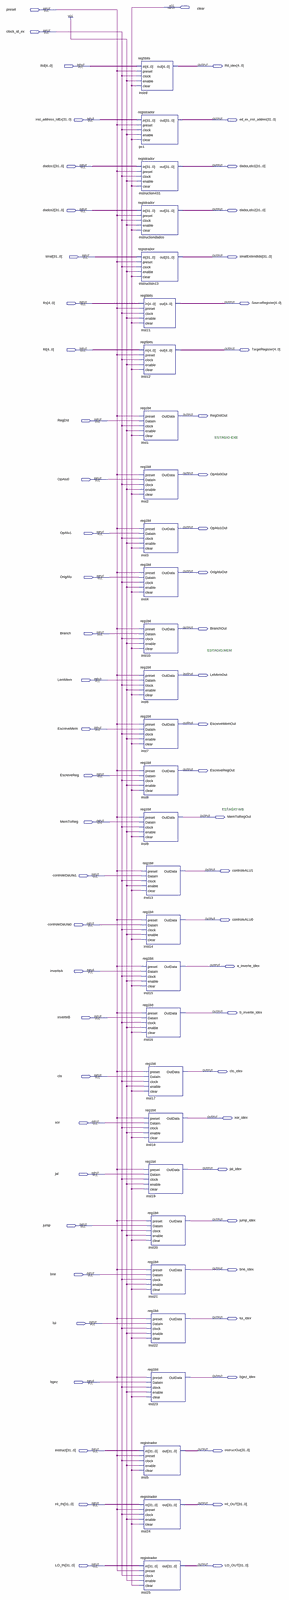
[diagram p0: schematic sheet, whole]
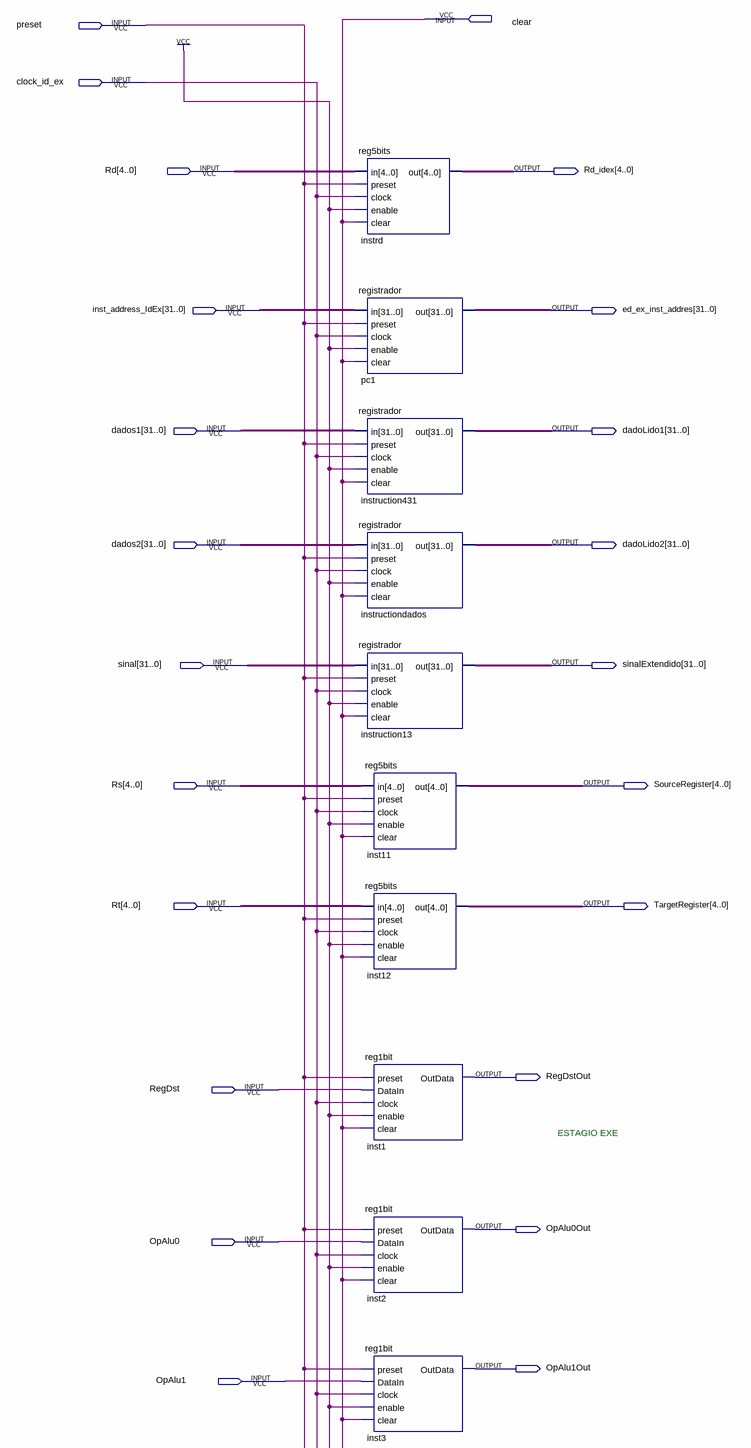
[diagram p1: schematic sheet, upper part]
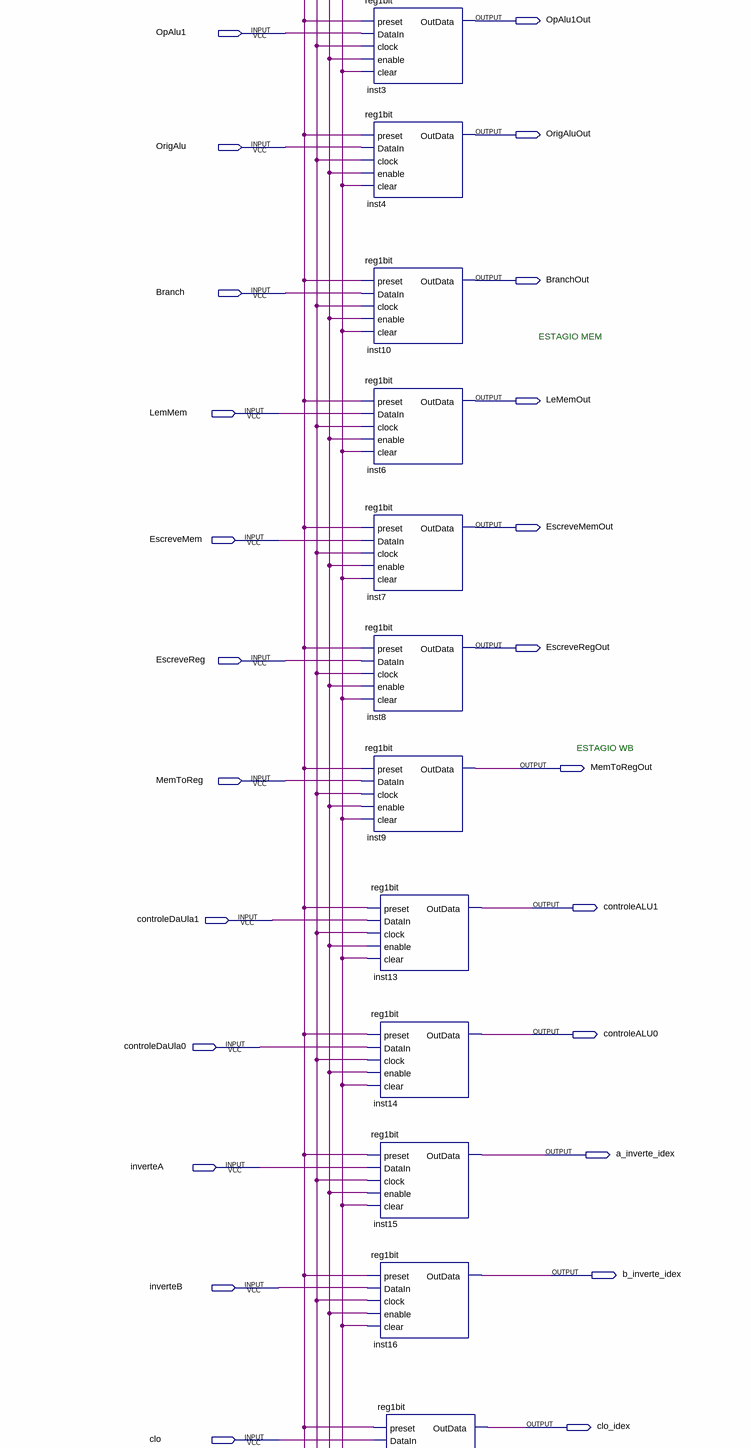
[diagram p2: schematic sheet, middle part]
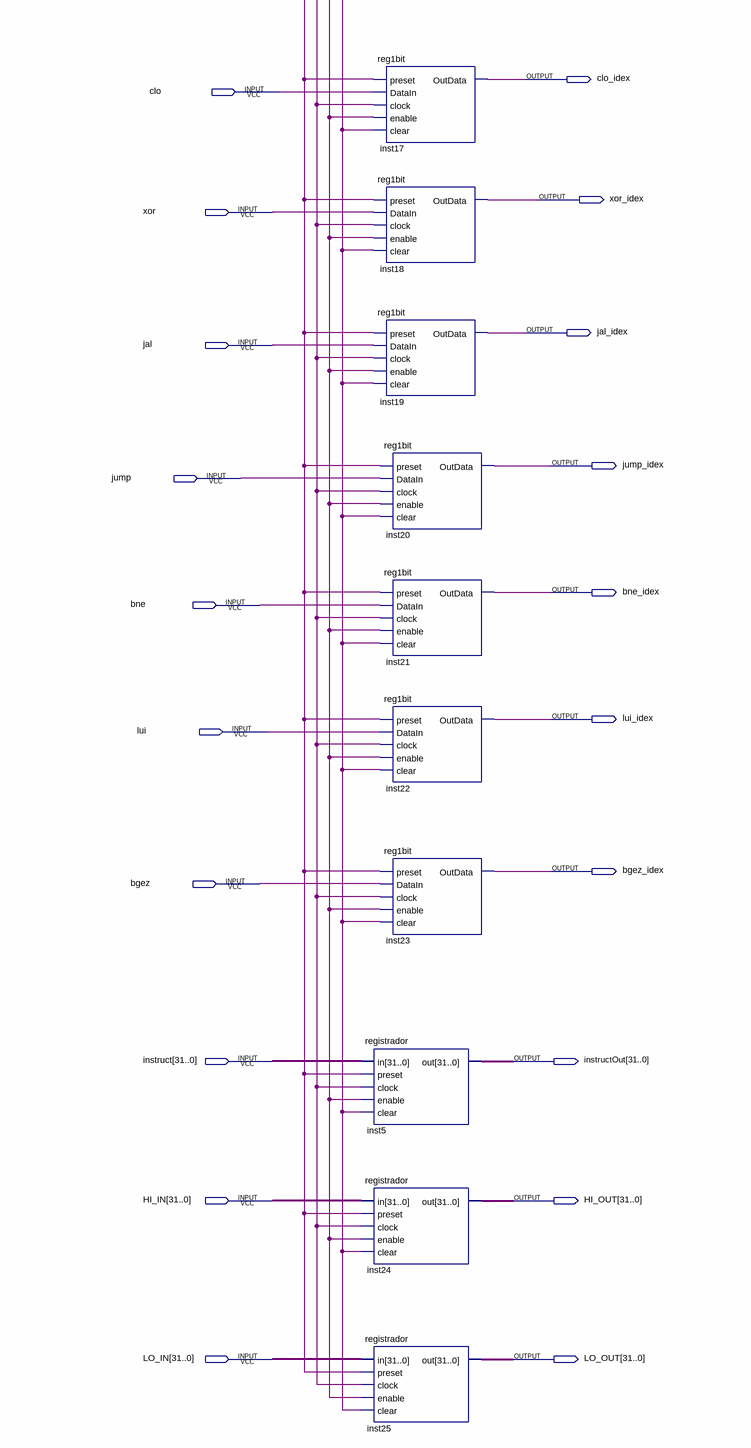
[diagram p3: schematic sheet, lower part]
// Quartus schematic IDEX.bdf as structural Verilog: 30 symbols, 63 pins
module IDEX (
  input  clear,
  input  preset,
  input  clock_id_ex,
  input  [4:0] Rd,
  input  [31:0] inst_address_IdEx,
  input  [31:0] dados1,
  input  [31:0] dados2,
  input  [31:0] sinal,
  input  [4:0] Rs,
  input  [4:0] Rt,
  input  RegDst,
  input  OpAlu0,
  input  OpAlu1,
  input  OrigAlu,
  input  Branch,
  input  LemMem,
  input  EscreveMem,
  input  EscreveReg,
  input  MemToReg,
  input  controleDaUla1,
  input  controleDaUla0,
  input  inverteA,
  input  inverteB,
  input  clo,
  input  \xor ,
  input  jal,
  input  jump,
  input  bne,
  input  lui,
  input  bgez,
  input  [31:0] instruct,
  input  [31:0] HI_IN,
  input  [31:0] LO_IN,
  output [4:0] Rd_idex,
  output [31:0] ed_ex_inst_addres,
  output [31:0] dadoLido1,
  output [31:0] dadoLido2,
  output [31:0] sinalExtendido,
  output [4:0] SourceRegister,
  output [4:0] TargetRegister,
  output RegDstOut,
  output OpAlu0Out,
  output OpAlu1Out,
  output OrigAluOut,
  output BranchOut,
  output LeMemOut,
  output EscreveMemOut,
  output EscreveRegOut,
  output MemToRegOut,
  output controleALU1,
  output controleALU0,
  output a_inverte_idex,
  output b_inverte_idex,
  output clo_idex,
  output xor_idex,
  output jal_idex,
  output jump_idex,
  output bne_idex,
  output lui_idex,
  output bgez_idex,
  output [31:0] instructOut,
  output [31:0] HI_OUT,
  output [31:0] LO_OUT
);

  reg5bits instrd (.in(Rd), .preset(preset), .clock(clock_id_ex), .enable(1'b1), .clear(clear), .out(Rd_idex));
  registrador pc1 (
    .in(inst_address_IdEx), .preset(preset), .clock(clock_id_ex), .enable(1'b1), .clear(clear),
    .out(ed_ex_inst_addres));
  registrador instruction431 (
    .in(dados1), .preset(preset), .clock(clock_id_ex), .enable(1'b1), .clear(clear), .out(dadoLido1));
  registrador instructiondados (
    .in(dados2), .preset(preset), .clock(clock_id_ex), .enable(1'b1), .clear(clear), .out(dadoLido2));
  registrador instruction13 (
    .in(sinal), .preset(preset), .clock(clock_id_ex), .enable(1'b1), .clear(clear), .out(sinalExtendido));
  reg5bits inst11 (.in(Rs), .preset(preset), .clock(clock_id_ex), .enable(1'b1), .clear(clear), .out(SourceRegister));
  reg5bits inst12 (.in(Rt), .preset(preset), .clock(clock_id_ex), .enable(1'b1), .clear(clear), .out(TargetRegister));
  reg1bit inst1 (
    .preset(preset), .DataIn(RegDst), .clock(clock_id_ex), .enable(1'b1), .clear(clear), .OutData(RegDstOut));
  reg1bit inst2 (
    .preset(preset), .DataIn(OpAlu0), .clock(clock_id_ex), .enable(1'b1), .clear(clear), .OutData(OpAlu0Out));
  reg1bit inst3 (
    .preset(preset), .DataIn(OpAlu1), .clock(clock_id_ex), .enable(1'b1), .clear(clear), .OutData(OpAlu1Out));
  reg1bit inst4 (
    .preset(preset), .DataIn(OrigAlu), .clock(clock_id_ex), .enable(1'b1), .clear(clear), .OutData(OrigAluOut));
  reg1bit inst10 (
    .preset(preset), .DataIn(Branch), .clock(clock_id_ex), .enable(1'b1), .clear(clear), .OutData(BranchOut));
  reg1bit inst6 (
    .preset(preset), .DataIn(LemMem), .clock(clock_id_ex), .enable(1'b1), .clear(clear), .OutData(LeMemOut));
  reg1bit inst7 (
    .preset(preset), .DataIn(EscreveMem), .clock(clock_id_ex), .enable(1'b1), .clear(clear),
    .OutData(EscreveMemOut));
  reg1bit inst8 (
    .preset(preset), .DataIn(EscreveReg), .clock(clock_id_ex), .enable(1'b1), .clear(clear),
    .OutData(EscreveRegOut));
  reg1bit inst9 (
    .preset(preset), .DataIn(MemToReg), .clock(clock_id_ex), .enable(1'b1), .clear(clear),
    .OutData(MemToRegOut));
  registrador inst5 (
    .in(instruct), .preset(preset), .clock(clock_id_ex), .enable(1'b1), .clear(clear), .out(instructOut));
  registrador inst24 (.in(HI_IN), .preset(preset), .clock(clock_id_ex), .enable(1'b1), .clear(clear), .out(HI_OUT));
  registrador inst25 (.in(LO_IN), .preset(preset), .clock(clock_id_ex), .enable(1'b1), .clear(clear), .out(LO_OUT));
  reg1bit inst13 (
    .preset(preset), .DataIn(controleDaUla1), .clock(clock_id_ex), .enable(1'b1), .clear(clear),
    .OutData(controleALU1));
  reg1bit inst14 (
    .preset(preset), .DataIn(controleDaUla0), .clock(clock_id_ex), .enable(1'b1), .clear(clear),
    .OutData(controleALU0));
  reg1bit inst15 (
    .preset(preset), .DataIn(inverteA), .clock(clock_id_ex), .enable(1'b1), .clear(clear),
    .OutData(a_inverte_idex));
  reg1bit inst16 (
    .preset(preset), .DataIn(inverteB), .clock(clock_id_ex), .enable(1'b1), .clear(clear),
    .OutData(b_inverte_idex));
  reg1bit inst17 (.preset(preset), .DataIn(clo), .clock(clock_id_ex), .enable(1'b1), .clear(clear), .OutData(clo_idex));
  reg1bit inst18 (
    .preset(preset), .DataIn(\xor ), .clock(clock_id_ex), .enable(1'b1), .clear(clear), .OutData(xor_idex));
  reg1bit inst19 (.preset(preset), .DataIn(jal), .clock(clock_id_ex), .enable(1'b1), .clear(clear), .OutData(jal_idex));
  reg1bit inst20 (
    .preset(preset), .DataIn(jump), .clock(clock_id_ex), .enable(1'b1), .clear(clear), .OutData(jump_idex));
  reg1bit inst21 (.preset(preset), .DataIn(bne), .clock(clock_id_ex), .enable(1'b1), .clear(clear), .OutData(bne_idex));
  reg1bit inst22 (.preset(preset), .DataIn(lui), .clock(clock_id_ex), .enable(1'b1), .clear(clear), .OutData(lui_idex));
  reg1bit inst23 (
    .preset(preset), .DataIn(bgez), .clock(clock_id_ex), .enable(1'b1), .clear(clear), .OutData(bgez_idex));

  // Notes on the sheet:
  //   ESTAGIO EXE
  //   ESTAGIO MEM
  //   ESTAGIO WB
endmodule
